# Altium schematic sheet 0.SchDoc
size A4
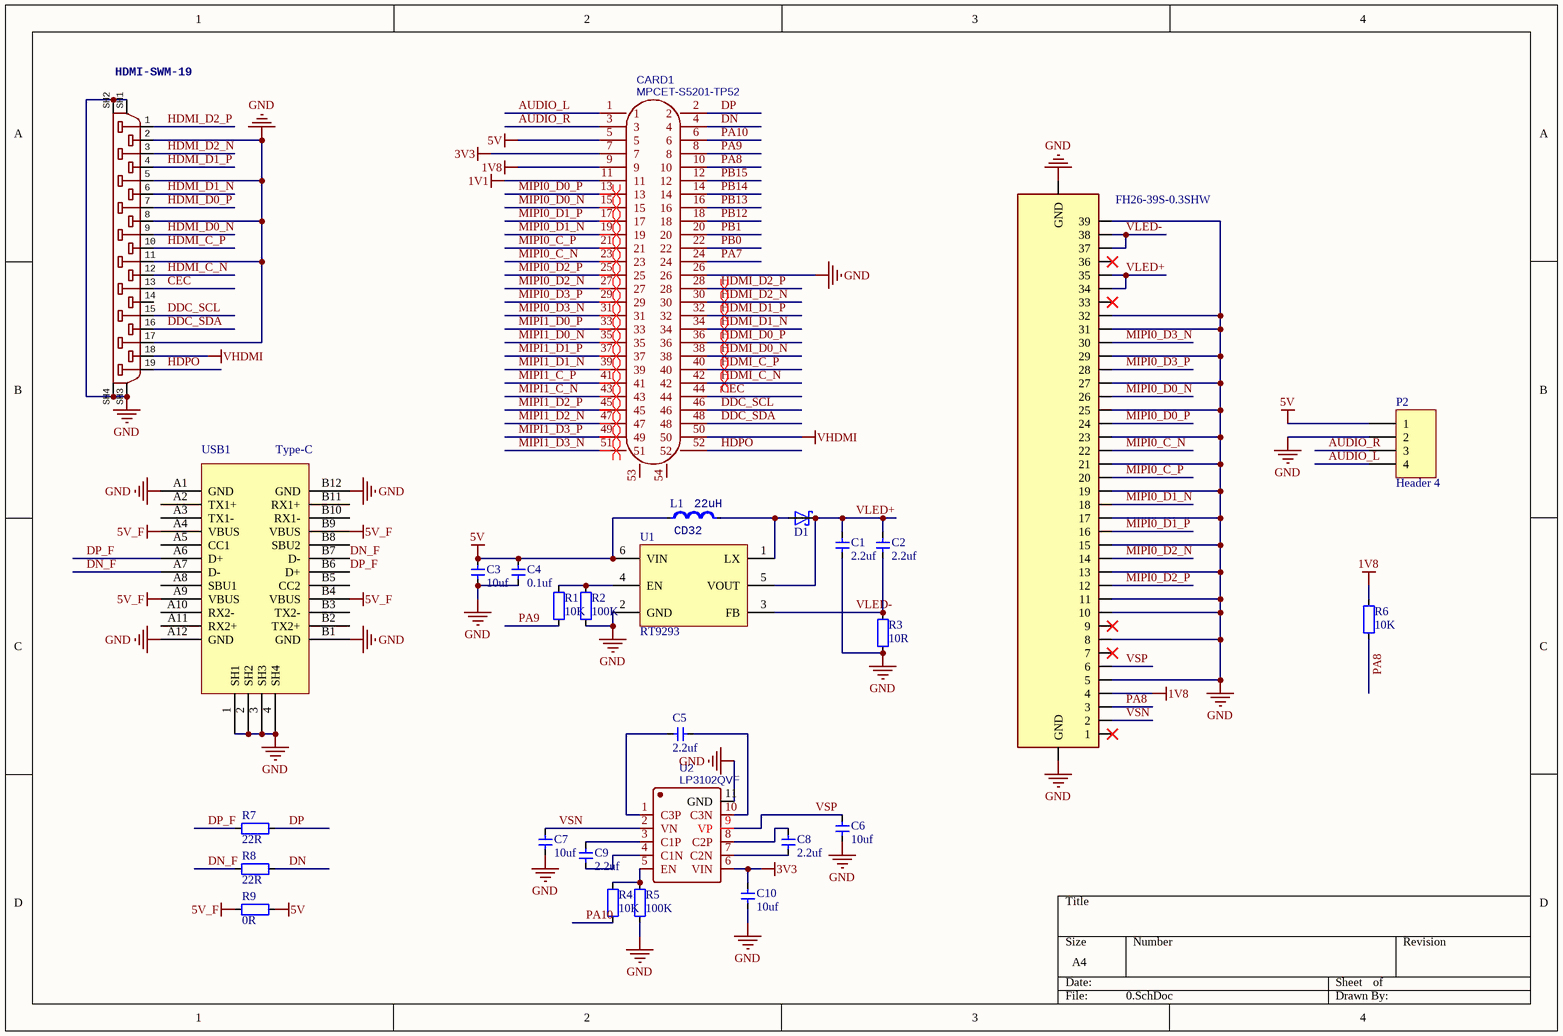
[diagram p0: 0.SchDoc]

## Parts
1  FH26-39S-0.3SHW  [FH26-39S-0.3SHW]
C1  2.2uf  [0603_CAP]
C2  2.2uf  [0603_CAP]
C3  10uf  [0603_CAP]
C4  0.1uf  [0603_CAP]
C5  2.2uf  [0603_CAP]
C6  10uf  [0603_CAP]
C7  10uf  [0603_CAP]
C8  2.2uf  [0603_CAP]
C9  2.2uf  [0603_CAP]
C10  10uf  [0603_CAP]
CARD1  MPCET-S5201-TP52  [MINI-PCIE-SMD_MPCET-S5201-TP40]
D1  RSX501L-20  [SOD-123F_L2.8-W1.8-LS3.7-RD]  (value not drawn)
HDMI  HDMI-SWM-19  [HDMI-SWM-19]
L1  value 22uH  [IND_CD32]  (hidden comment: CD32)
P2  Header 4  [HDR1X4]
R1  10K  [0603_RES]
R2  100K  [0603_RES]
R3  10R  [0603_RES]
R4  10K  [0603_RES]
R5  100K  [0603_RES]
R6  10K  [0603_RES]
R7  22R  [0603_RES]
R8  22R  [0603_RES]
R9  0R  [0603_RES]
U1  RT9293  [SOT23-6]
U2  LP3102QVF  [TDFN-10_L3.0-W3.0-P0.50-BL-EP]
USB1  Type-C  [Type-C-TOP]

## Nets
1V1: CARD1.11
1V8: 1.4 CARD1.9 R6.1
3V3: C10.2 CARD1.7 U2.6(VIN)
5V: C3.2 C4.2 CARD1.5 L1.1 P2.1 R9.2 U1.6(VIN)
5V_F: R9.1 USB1.A4(VBUS) USB1.A9(VBUS) USB1.B4(VBUS) USB1.B9(VBUS)
GND: 1.5 1.8 1.10 1.11 1.13 1.15 1.17 1.19 1.21 1.23 1.25 1.27 1.29 1.31 1.32 1.39 1.GND1(GND) 1.GND2(GND) C1.1 C3.1 C4.1 C6.1 C7.1 C10.1 CARD1.26 HDMI.2 HDMI.5 HDMI.8 HDMI.11 HDMI.17 HDMI.SH1 HDMI.SH2 HDMI.SH3 HDMI.SH4 P2.2 R2.2 R3.2 R5.2 U1.2(GND) U2.11(GND) USB1.1(SH1) USB1.2(SH2) USB1.3(SH3) USB1.4(SH4) USB1.A1(GND) USB1.A12(GND) USB1.B1(GND) USB1.B12(GND)
VHDMI: CARD1.50 HDMI.18
AUDIO_L: CARD1.1 P2.4
AUDIO_R: CARD1.3 P2.3
CEC: CARD1.44 HDMI.13
DDC_SCL: CARD1.46 HDMI.15
DDC_SDA: CARD1.48 HDMI.16
DN: CARD1.4 R8.2
DN_F: R8.1 USB1.A7(D-) USB1.B7(D-)
DP: CARD1.2 R7.2
DP_F: R7.1 USB1.A6(D+) USB1.B6(D+)
HDMI_C_N: CARD1.42 HDMI.12
HDMI_C_P: CARD1.40 HDMI.10
HDMI_D0_N: CARD1.38 HDMI.9
HDMI_D0_P: CARD1.36 HDMI.7
HDMI_D1_N: CARD1.34 HDMI.6
HDMI_D1_P: CARD1.32 HDMI.4
HDMI_D2_N: CARD1.30 HDMI.3
HDMI_D2_P: CARD1.28 HDMI.1
HDPO: CARD1.52 HDMI.19
MIPI0_C_N: 1.22 CARD1.23
MIPI0_C_P: 1.20 CARD1.21
MIPI0_D0_N: 1.26 CARD1.15
MIPI0_D0_P: 1.24 CARD1.13
MIPI0_D1_N: 1.18 CARD1.19
MIPI0_D1_P: 1.16 CARD1.17
MIPI0_D2_N: 1.14 CARD1.27
MIPI0_D2_P: 1.12 CARD1.25
MIPI0_D3_N: 1.30 CARD1.31
MIPI0_D3_P: 1.28 CARD1.29
MIPI1_C_N: CARD1.43
MIPI1_C_P: CARD1.41
MIPI1_D0_N: CARD1.35
MIPI1_D0_P: CARD1.33
MIPI1_D1_N: CARD1.39
MIPI1_D1_P: CARD1.37
MIPI1_D2_N: CARD1.47
MIPI1_D2_P: CARD1.45
MIPI1_D3_N: CARD1.51
MIPI1_D3_P: CARD1.49
PA7: CARD1.24
PA8: 1.3 CARD1.10 R6.2
PA9: CARD1.8 R1.2
PA10: CARD1.6 R4.2
PB0: CARD1.22
PB1: CARD1.20
PB12: CARD1.18
PB13: CARD1.16
PB14: CARD1.14
PB15: CARD1.12
VLED+: 1.34 1.35 C1.2 C2.2 D1.1 U1.5(VOUT)
VLED-: 1.37 1.38 C2.1 R3.1 U1.3(FB)
VSN: 1.2 C7.2 U2.2(VN)
VSP: 1.6 C6.2 U2.9(VP)
NetC5_1: C5.1 U2.10(C3N)
NetC5_2: C5.2 U2.1(C3P)
NetC8_1: C8.1 U2.8(C2P)
NetC8_2: C8.2 U2.7(C2N)
NetC9_1: C9.1 U2.3(C1P)
NetC9_2: C9.2 U2.4(C1N)
NetD1_2: D1.2 L1.2 U1.1(LX)
NetR1_1: R1.1 R2.1 U1.4(EN)
NetR4_1: R4.1 R5.1 U2.5(EN)

Not connected (* = marked no-connect by the designer): 1 1* 7* 9* 33* 36*; CARD1 53 54; HDMI 14; USB1 A2(TX1+) A3(TX1-) A5(CC1) A8(SBU1) A10(RX2-) A11(RX2+) B2(TX2+) B3(TX2-) B5(CC2) B8(SBU2) B10(RX1-) B11(RX1+)

## Layout directives
differential pair: HDMI_C_N, HDMI_C_P, HDMI_D0_N, HDMI_D0_P, HDMI_D1_N, HDMI_D1_P, HDMI_D2_N, HDMI_D2_P, MIPI0_C_N, MIPI0_C_P, MIPI0_D0_N, MIPI0_D0_P, MIPI0_D1_N, MIPI0_D1_P, MIPI0_D2_N, MIPI0_D2_P, MIPI0_D3_N, MIPI0_D3_P, MIPI1_C_N, MIPI1_C_P, MIPI1_D0_N, MIPI1_D0_P, MIPI1_D1_N, MIPI1_D1_P, MIPI1_D2_N, MIPI1_D2_P, MIPI1_D3_N, MIPI1_D3_P

## Library data of the parts
1 = FH26-39S-0.3SHW: 39 Position FPC Connector Contacts, Bottom 0.012 _0.30mm_ Surface Mount, Right Angle; MF: Hirose; Package: None; Value: *; Availability: Unavailable; MP: FH26-39S-0.3SHW; SnapEDA_Link: https://www.snapeda.com/parts/FH26-39S-0.3SHW/Hirose/view-part/44187/?ref=snap; Price: None
C1-C10 = 电容-0402: Capacitor; Value: 0.1u
CARD1 = MPCET-S5201-TP52: BOM_Manufacturer: Argosy Research Inc.; Contributor: LCSC; BOM_Supplier: LCSC; BOM_Supplier Part: C367018; BOM_Manufacturer Part: MPCET-S5201-TP52; spicePre: C; spiceSymbolName: MPCET-S5201-TP52
D1 = RSX501L-20: Diode Schottky 40V 1A Surface Mount SMA _DO-214AC_; MP: SS14; MF: ON Semiconductor; Package: DO-214AC-214 ON Semiconductor; Value: *; Availability: Unavailable; Price: None; SnapEDA_Link: https://www.snapeda.com/parts/SS14/ON%20Semiconductor/view-part/1413348/?ref=snap
HDMI = HDMI-MC34931HDMI-SWM-19
L1 = Ind_CD32: Inductor; Specification: ±5% 100mA; Manufacturer: *; Type: CD32
P2 = Header 4: Header, 4-Pin; LatestRevisionDate: 17-Jul-2002; LatestRevisionNote: Re-released for DXP Platform.; Publisher: Altium Limited
R1-R6 R9 = 电阻-0402: Resistor; Value: 22R
R7 R8 = 电阻-0402: Resistor; Value: 22R
U1 = RT9293: LCD-LED Driver
U2 = LP3102QVF: BOM_Manufacturer: LOWPOWER; Contributor: LCSC; SMT Type: Extend; BOM_Supplier: LCSC; BOM_Supplier Part: C517005; BOM_Manufacturer Part: LP3102QVF; BOM_JLCPCB SMD: Yes; spicePre: U; spiceSymbolName: LP3102QVF
USB1 = USB-Type-C-TOP